# Altium schematic sheet STM32F103VET6.SchDoc: STM32F103VET6
size A4; DrawnBy: WDC; Revision: WQB; SheetNumber: 2; SheetTotal: 11
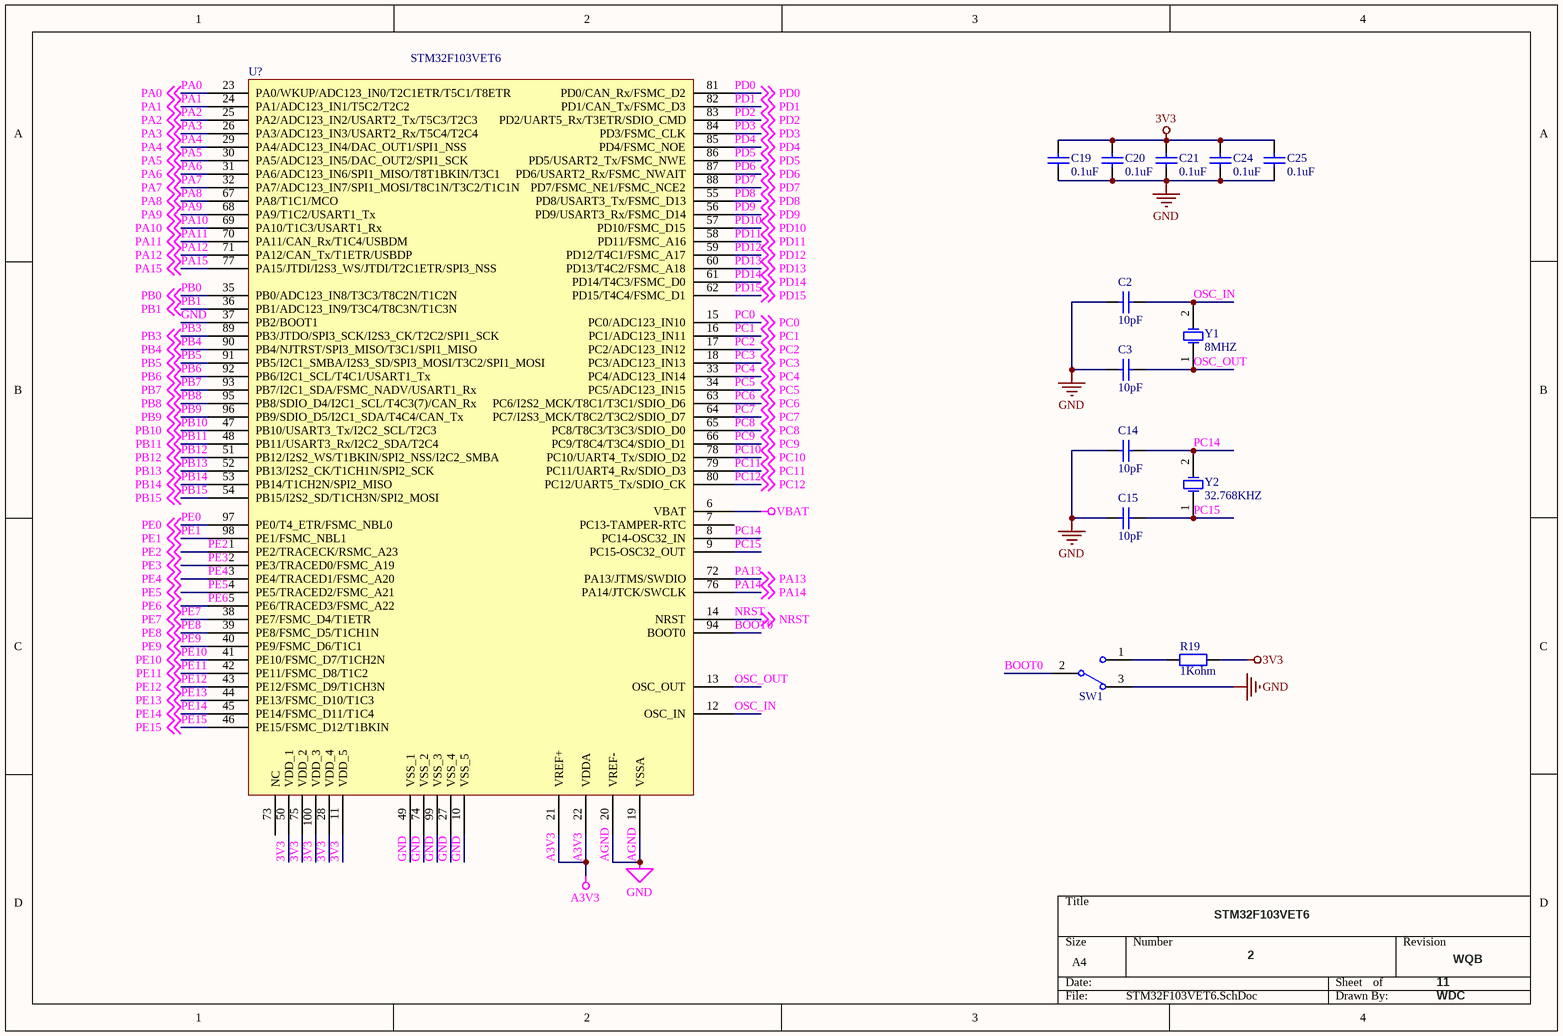
[diagram p0: STM32F103VET6.SchDoc]

## Parts
C2  10pF  [0805]
C3  10pF  [0805]
C14  10pF  [0805]
C15  10pF  [0805]
C19  0.1uF  [0805]
C20  0.1uF  [0805]
C21  0.1uF  [0805]
C24  0.1uF  [0805]
C25  0.1uF  [0805]
R19  1Kohm  [0805]
SW1  SW-SPDT  [SWITCH-A1]  (value not drawn)
U?  STM32F103VET6  [LQFP-100M]
Y1  8MHZ  [X-HC49U]
Y2  32.768KHZ  [X-HC49U]

## Nets
3V3: C19.2 C20.2 C21.2 C24.2 C25.2 R19.2 U?.11(VDD_5) U?.28(VDD_4) U?.50(VDD_1) U?.75(VDD_2) U?.100(VDD_3)
A3V3: U?.21(VREF+) U?.22(VDDA)
AGND: C2.1 C3.1 C14.1 C15.1 C19.1 C20.1 C21.1 C24.1 C25.1 SW1.3 U?.10(VSS_5) U?.19(VSSA) U?.20(VREF-) U?.27(VSS_4) U?.37(PB2/BOOT1) U?.49(VSS_1) U?.74(VSS_2) U?.99(VSS_3)  [also labelled GND]
VBAT: U?.6(VBAT)
BOOT0: SW1.2 U?.94(BOOT0)
NRST: U?.14(NRST) ; off-sheet NRST
OSC_IN: C2.2 U?.12(OSC_IN) Y1.2(OSC2)
OSC_OUT: C3.2 U?.13(OSC_OUT) Y1.1(OSC1)
PA0: U?.23(PA0/WKUP/ADC123_IN0/T2C1ETR/T5C1/T8ETR) ; off-sheet PA0
PA1: U?.24(PA1/ADC123_IN1/T5C2/T2C2) ; off-sheet PA1
PA2: U?.25(PA2/ADC123_IN2/USART2_Tx/T5C3/T2C3) ; off-sheet PA2
PA3: U?.26(PA3/ADC123_IN3/USART2_Rx/T5C4/T2C4) ; off-sheet PA3
PA4: U?.29(PA4/ADC123_IN4/DAC_OUT1/SPI1_NSS) ; off-sheet PA4
PA5: U?.30(PA5/ADC123_IN5/DAC_OUT2/SPI1_SCK) ; off-sheet PA5
PA6: U?.31(PA6/ADC123_IN6/SPI1_MISO/T8T1BKIN/T3C1) ; off-sheet PA6
PA7: U?.32(PA7/ADC123_IN7/SPI1_MOSI/T8C1N/T3C2/T1C1N) ; off-sheet PA7
PA8: U?.67(PA8/T1C1/MCO) ; off-sheet PA8
PA9: U?.68(PA9/T1C2/USART1_Tx) ; off-sheet PA9
PA10: U?.69(PA10/T1C3/USART1_Rx) ; off-sheet PA10
PA11: U?.70(PA11/CAN_Rx/T1C4/USBDM) ; off-sheet PA11
PA12: U?.71(PA12/CAN_Tx/T1ETR/USBDP) ; off-sheet PA12
PA13: U?.72(PA13/JTMS/SWDIO) ; off-sheet PA13
PA14: U?.76(PA14/JTCK/SWCLK) ; off-sheet PA14
PA15: U?.77(PA15/JTDI/I2S3_WS/JTDI/T2C1ETR/SPI3_NSS) ; off-sheet PA15
PB0: U?.35(PB0/ADC123_IN8/T3C3/T8C2N/T1C2N) ; off-sheet PB0
PB1: U?.36(PB1/ADC123_IN9/T3C4/T8C3N/T1C3N) ; off-sheet PB1
PB3: U?.89(PB3/JTDO/SPI3_SCK/I2S3_CK/T2C2/SPI1_SCK) ; off-sheet PB3
PB4: U?.90(PB4/NJTRST/SPI3_MISO/T3C1/SPI1_MISO) ; off-sheet PB4
PB5: U?.91(PB5/I2C1_SMBA/I2S3_SD/SPI3_MOSI/T3C2/SPI1_MOSI) ; off-sheet PB5
PB6: U?.92(PB6/I2C1_SCL/T4C1/USART1_Tx) ; off-sheet PB6
PB7: U?.93(PB7/I2C1_SDA/FSMC_NADV/USART1_Rx) ; off-sheet PB7
PB8: U?.95(PB8/SDIO_D4/I2C1_SCL/T4C3(7)/CAN_Rx) ; off-sheet PB8
PB9: U?.96(PB9/SDIO_D5/I2C1_SDA/T4C4/CAN_Tx) ; off-sheet PB9
PB10: U?.47(PB10/USART3_Tx/I2C2_SCL/T2C3) ; off-sheet PB10
PB11: U?.48(PB11/USART3_Rx/I2C2_SDA/T2C4) ; off-sheet PB11
PB12: U?.51(PB12/I2S2_WS/T1BKIN/SPI2_NSS/I2C2_SMBA) ; off-sheet PB12
PB13: U?.52(PB13/I2S2_CK/T1CH1N/SPI2_SCK) ; off-sheet PB13
PB14: U?.53(PB14/T1CH2N/SPI2_MISO) ; off-sheet PB14
PB15: U?.54(PB15/I2S2_SD/T1CH3N/SPI2_MOSI) ; off-sheet PB15
PC0: U?.15(PC0/ADC123_IN10) ; off-sheet PC0
PC1: U?.16(PC1/ADC123_IN11) ; off-sheet PC1
PC2: U?.17(PC2/ADC123_IN12) ; off-sheet PC2
PC3: U?.18(PC3/ADC123_IN13) ; off-sheet PC3
PC4: U?.33(PC4/ADC123_IN14) ; off-sheet PC4
PC5: U?.34(PC5/ADC123_IN15) ; off-sheet PC5
PC6: U?.63(PC6/I2S2_MCK/T8C1/T3C1/SDIO_D6) ; off-sheet PC6
PC7: U?.64(PC7/I2S3_MCK/T8C2/T3C2/SDIO_D7) ; off-sheet PC7
PC8: U?.65(PC8/T8C3/T3C3/SDIO_D0) ; off-sheet PC8
PC9: U?.66(PC9/T8C4/T3C4/SDIO_D1) ; off-sheet PC9
PC10: U?.78(PC10/UART4_Tx/SDIO_D2) ; off-sheet PC10
PC11: U?.79(PC11/UART4_Rx/SDIO_D3) ; off-sheet PC11
PC12: U?.80(PC12/UART5_Tx/SDIO_CK) ; off-sheet PC12
PC14: C14.2 U?.8(PC14-OSC32_IN) Y2.2(OSC2)
PC15: C15.2 U?.9(PC15-OSC32_OUT) Y2.1(OSC1)
PD0: U?.81(PD0/CAN_Rx/FSMC_D2) ; off-sheet PD0
PD1: U?.82(PD1/CAN_Tx/FSMC_D3) ; off-sheet PD1
PD2: U?.83(PD2/UART5_Rx/T3ETR/SDIO_CMD) ; off-sheet PD2
PD3: U?.84(PD3/FSMC_CLK) ; off-sheet PD3
PD4: U?.85(PD4/FSMC_NOE) ; off-sheet PD4
PD5: U?.86(PD5/USART2_Tx/FSMC_NWE) ; off-sheet PD5
PD6: U?.87(PD6/USART2_Rx/FSMC_NWAIT) ; off-sheet PD6
PD7: U?.88(PD7/FSMC_NE1/FSMC_NCE2) ; off-sheet PD7
PD8: U?.55(PD8/USART3_Tx/FSMC_D13) ; off-sheet PD8
PD9: U?.56(PD9/USART3_Rx/FSMC_D14) ; off-sheet PD9
PD10: U?.57(PD10/FSMC_D15) ; off-sheet PD10
PD11: U?.58(PD11/FSMC_A16) ; off-sheet PD11
PD12: U?.59(PD12/T4C1/FSMC_A17) ; off-sheet PD12
PD13: U?.60(PD13/T4C2/FSMC_A18) ; off-sheet PD13
PD14: U?.61(PD14/T4C3/FSMC_D0) ; off-sheet PD14
PD15: U?.62(PD15/T4C4/FSMC_D1) ; off-sheet PD15
PE0: U?.97(PE0/T4_ETR/FSMC_NBL0) ; off-sheet PE0
PE1: U?.98(PE1/FSMC_NBL1) ; off-sheet PE1
PE2: U?.1(PE2/TRACECK/RSMC_A23) ; off-sheet PE2
PE3: U?.2(PE3/TRACED0/FSMC_A19) ; off-sheet PE3
PE4: U?.3(PE4/TRACED1/FSMC_A20) ; off-sheet PE4
PE5: U?.4(PE5/TRACED2/FSMC_A21) ; off-sheet PE5
PE6: U?.5(PE6/TRACED3/FSMC_A22) ; off-sheet PE6
PE7: U?.38(PE7/FSMC_D4/T1ETR) ; off-sheet PE7
PE8: U?.39(PE8/FSMC_D5/T1CH1N) ; off-sheet PE8
PE9: U?.40(PE9/FSMC_D6/T1C1) ; off-sheet PE9
PE10: U?.41(PE10/FSMC_D7/T1CH2N) ; off-sheet PE10
PE11: U?.42(PE11/FSMC_D8/T1C2) ; off-sheet PE11
PE12: U?.43(PE12/FSMC_D9/T1CH3N) ; off-sheet PE12
PE13: U?.44(PE13/FSMC_D10/T1C3) ; off-sheet PE13
PE14: U?.45(PE14/FSMC_D11/T1C4) ; off-sheet PE14
PE15: U?.46(PE15/FSMC_D12/T1BKIN) ; off-sheet PE15
NetR19_1: R19.1 SW1.1

Not connected (* = marked no-connect by the designer): U? 7(PC13-TAMPER-RTC) 73(NC)

## Library data of the parts
C2 C3 C14 C15 C19-C21 C24 C25 = Cap1: 贴片电容; Value: 100pF; Published: 8-Jun-2000; LatestRevisionDate: 17-Jul-2002; LatestRevisionNote: Re-released for DXP Platform.; PackageReference: RAD-0.3; Publisher: Altium Limited
R19 = Res1: 贴片电阻; Value: 1K; Published: 8-Jun-2000; LatestRevisionDate: 17-Jul-2002; LatestRevisionNote: Re-released for DXP Platform.; PackageReference: AXIAL-0.4; Publisher: Altium Limited
SW1 = SW SPDT: 开关; Published: 24-Mar-1999; LatestRevisionDate: 17-Dec-2003; LatestRevisionNote: Schematic revised, PCB Footprint replaced.; DatasheetDocument: 05-Dec-2000; PackageReference: TL36WW15050; Publisher: Altium Limited; ComponentLink1Description: Manufacturer Link; ComponentLink1URL: http://www.apem.com
U? = STM32F103V: STM32单片机100引脚
Y1 Y2 = XTAL_1: Crystal Oscillator; Published: 8-Jun-2000; LatestRevisionDate: 17-Jul-2002; LatestRevisionNote: Re-released for DXP Platform.; PackageReference: R38; Publisher: Altium Limited